# Altium schematic sheet Wireless.SchDoc
size A4
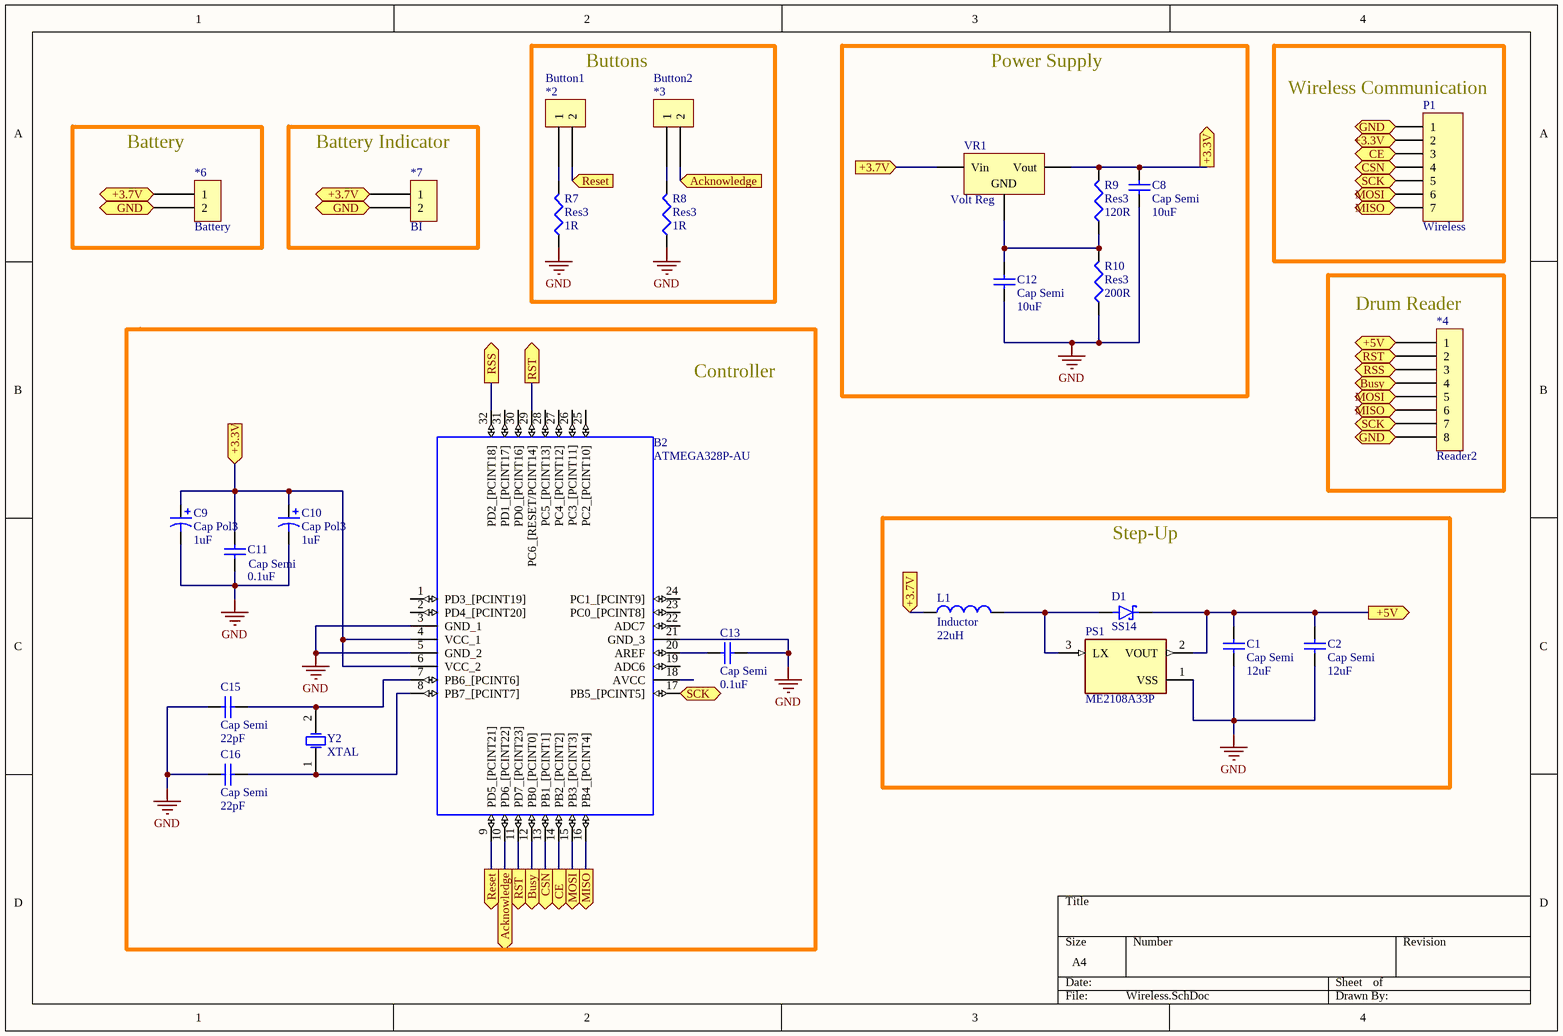
[diagram p0: Wireless.SchDoc]

## Parts
*2  Button1  [HDR1X2]
*3  Button2  [HDR1X2]
*4  Reader2  [HDR1X8]
*6  Battery  [HDR1X2]
*7  BI  [HDR1X2]
B2  ATMEGA328P-AU  [QFP80P900X900X120-32N]
C1  Cap Semi  value 12uF  [1608[0603]]
C2  Cap Semi  value 12uF  [1608[0603]]
C8  Cap Semi  value 10uF  [1608[0603]]
C9  Cap Pol3  value 1uF  [C0805]
C10  Cap Pol3  value 1uF  [C0805]
C11  Cap Semi  value 0.1uF  [1608[0603]]
C12  Cap Semi  value 10uF  [1608[0603]]
C13  Cap Semi  value 0.1uF  [1608[0603]]
C15  Cap Semi  value 22pF  [1608[0603]]
C16  Cap Semi  value 22pF  [1608[0603]]
D1  SS14  [DIOM4325X250N]
L1  Inductor  value 22uH  [0402-A]
P1  Wireless  [HDR1X7]
PS1  ME2108A33P  [CONV_ME2108A33P]
R7  Res3  value 1R  [J1-0603]
R8  Res3  value 1R  [J1-0603]
R9  Res3  value 120R  [J1-0603]
R10  Res3  value 200R  [J1-0603]
VR1  Volt Reg  [VREG_LM1117MPX-3.3]
Y2  XTAL  [R38]

## Blocks framed on the sheet
Buttons: *2 *3 R7 R8
Power Supply: C8 C12 R9 R10 VR1
Wireless Communication: P1
Battery: *6
Battery Indicator: *7
Drum Reader: *4
Controller: B2 C9-C11 C13 C15 C16 Y2
Step-Up: C1 C2 D1 L1 PS1

## Ports
+3.3V (in), +3.3V (out), +3.7V (in), +3.7V (out), +5V (in), +5V (out), Acknowledge (in), Acknowledge (out), Busy (in), Busy (out), CE (in), CE (out), CSN (in), CSN (out), GND (in), GND (out), MISO (in), MISO (out), MOSI (in), MOSI (out), Reset (in), Reset (out), RSS (in), RSS (out), RST (in), RST (out), SCK (in)

## Nets
GND: B2.3(GND_1) B2.5(GND_2) B2.21(GND_3) C1.1 C2.1 C8.1 C9.2 C10.2 C11.1 C12.1 C13.2 C15.1 C16.1 PS1.1(VSS) R7.1 R8.1 R10.1
+3.3V: B2.4(VCC_1) B2.6(VCC_2) C8.2 C9.1 C10.1 C11.2 P1.2 R9.2 VR1.3(Vout) ; port +3.3V
+3.7V: *6.1 *7.1 L1.1 VR1.1(Vin) ; port +3.7V
+5V: *4.1 C1.2 C2.2 D1.C(K) PS1.2(VOUT) ; port +5V
Acknowledge: *3.2 B2.10(PD6_[PCINT22]) ; port Acknowledge
Busy: *4.4 B2.12(PB0_[PCINT0]) ; port Busy
CE: B2.14(PB2_[PCINT2]) P1.3 ; port CE
CSN: B2.13(PB1_[PCINT1]) P1.4 ; port CSN
GND: *4.8 *6.2 *7.2 P1.1 ; port GND  [a separate net that carries the same name]
MISO: *4.6 B2.16(PB4_[PCINT4]) P1.7 ; port MISO
MOSI: *4.5 B2.15(PB3_[PCINT3]) P1.6 ; port MOSI
Reset: *2.2 B2.9(PD5_[PCINT21]) ; port Reset
RSS: *4.3 B2.32(PD2_[PCINT18]) ; port RSS
RST: *4.2 B2.11(PD7_[PCINT23]) B2.29(PC6_[RESET/PCINT14]) ; port RST
SCK: *4.7 B2.17(PB5_[PCINT5]) P1.5 ; port SCK
Net*2_1: *2.1 R7.2
Net*3_1: *3.1 R8.2
NetB2_7: B2.7(PB6_[PCINT6]) C15.2 Y2.2(OSC2)
NetB2_8: B2.8(PB7_[PCINT7]) C16.2 Y2.1(OSC1)
NetB2_20: B2.20(AREF) C13.1
NetC12_2: C12.2 R9.1 R10.2 VR1.2(GND)
NetD1_A: D1.A L1.2 PS1.3(LX)

Not connected (* = marked no-connect by the designer): B2 1(PD3_[PCINT19]) 2(PD4_[PCINT20]) 18(AVCC) 19(ADC6) 22(ADC7) 23(PC0_[PCINT8]) 24(PC1_[PCINT9]) 25(PC2_[PCINT10]) 26(PC3_[PCINT11]) 27(PC4_[PCINT12]) 28(PC5_[PCINT13]) 30(PD0_[PCINT16]) 31(PD1_[PCINT17])

## Library data of the parts
*2 *3 *6 *7 = Header 2x1
*4 = Header 1x8
B2 = ATMEGA328P-AU: MICROCHIP - ATMEGA328P-AU. - MICROCONTROLLER MCU, 8 BIT, ATMEGA, 20MHZ, TQFP-32; Geometry.Height: 1.2mm; Manufacturer_Name: Microchip; Manufacturer_Part_Number: ATMEGA328P-AU; RS Part Number: 1310271; RS Price/Stock: http://uk.rs-online.com/web/p/products/1310271; Mouser Part Number: 556-ATMEGA328P-AU; Mouser Price/Stock: https://www.mouser.com/Search/Refine.aspx?Keyword=556-ATMEGA328P-AU; Datasheet Link: https://componentsearchengine.com/Datasheets/2/ATMEGA328P-AU.pdf
C1 C2 C8 C11-C13 C15 C16 = Cap Semi: Capacitor (Semiconductor SIM Model); Published: 8-Jun-2000; LatestRevisionDate: 29-May-2009; LatestRevisionNote: IPC-7351 Footprint Added.; PackageReference: C1206; Publisher: Altium Limited; PackageDescription: Chip Capacitor
C9 C10 = Cap Pol3: Polarized Capacitor (Surface Mount); Published: 8-Jun-2000; LatestRevisionDate: 29-May-2009; LatestRevisionNote: IPC-7351 Footprint Added.; PackageReference: C0805; Publisher: Altium Limited; PackageDescription: Chip Capacitor
D1 = SS14: 1A, 40V, Schottky Rectifier; MF: Taiwan Semiconductor; SnapEDA_Link: https://www.snapeda.com/parts/SS14/taiwan/view-part/?ref=snap; Package: SMA-2 Taiwan Semiconductor; Value: *; MP: SS14; Check_prices: https://www.snapeda.com/parts/SS14/taiwan/view-part/?ref=eda
L1 = Inductor: Code_IEC: 1005; Published: 8-Jun-2000; LatestRevisionDate: 29-May-2009; LatestRevisionNote: IPC-7351 Footprint Added.; PackageReference: 0402-A; Publisher: Altium Limited; PackageDescription: Chip Inductor; Code_JEITA: 0402
P1 = Header 7: Header, 7-Pin; LatestRevisionDate: 17-Jul-2002; LatestRevisionNote: Re-released for DXP Platform.; Publisher: Altium Limited
PS1 = ME2108A33P: PFM Step-up Step-up Step-up Step-up DC/DC Converter; MF: Nanjing Micro One Electronics; Availability: Not in stock; SnapEDA_Link: https://www.snapeda.com/parts/ME2108A33P/Nanjing+Micro+One+Electronics/view-part/?ref=snap; Price: None; Check_prices: https://www.snapeda.com/parts/ME2108A33P/Nanjing+Micro+One+Electronics/view-part/?ref=eda; Package: Package; MP: ME2108A33P; Value: *
R7-R10 = Res3: Resistor; Published: 8-Jun-2000; LatestRevisionDate: 29-May-2009; LatestRevisionNote: IPC-7351 Footprint Added.; PackageReference: J1-0603; Publisher: Altium Limited; PackageDescription: Chip Resistor
VR1 = Volt Reg: Voltage Regulator; Published: 24-Mar-1999; LatestRevisionDate: 29-May-2009; LatestRevisionNote: IPC-7351 Footprint Added.; PackageReference: D2PAK; Publisher: Altium Limited; PackageDescription: 3-Pin Transistor Outline Package 2.54 mm Pitch, 15.1 mm Lead Span
Y2 = XTAL: Crystal Oscillator; Published: 8-Jun-2000; LatestRevisionDate: 17-Jul-2002; LatestRevisionNote: Re-released for DXP Platform.; PackageReference: R38; Publisher: Altium Limited; PackageDescription: Crystal, Thru-Hole; 2 Leads; Body 3.1 x 8.2 mm (Dia.xH)